# EAGLE design AA Sensor Board Reference Design (EAGLE 9.0.0)
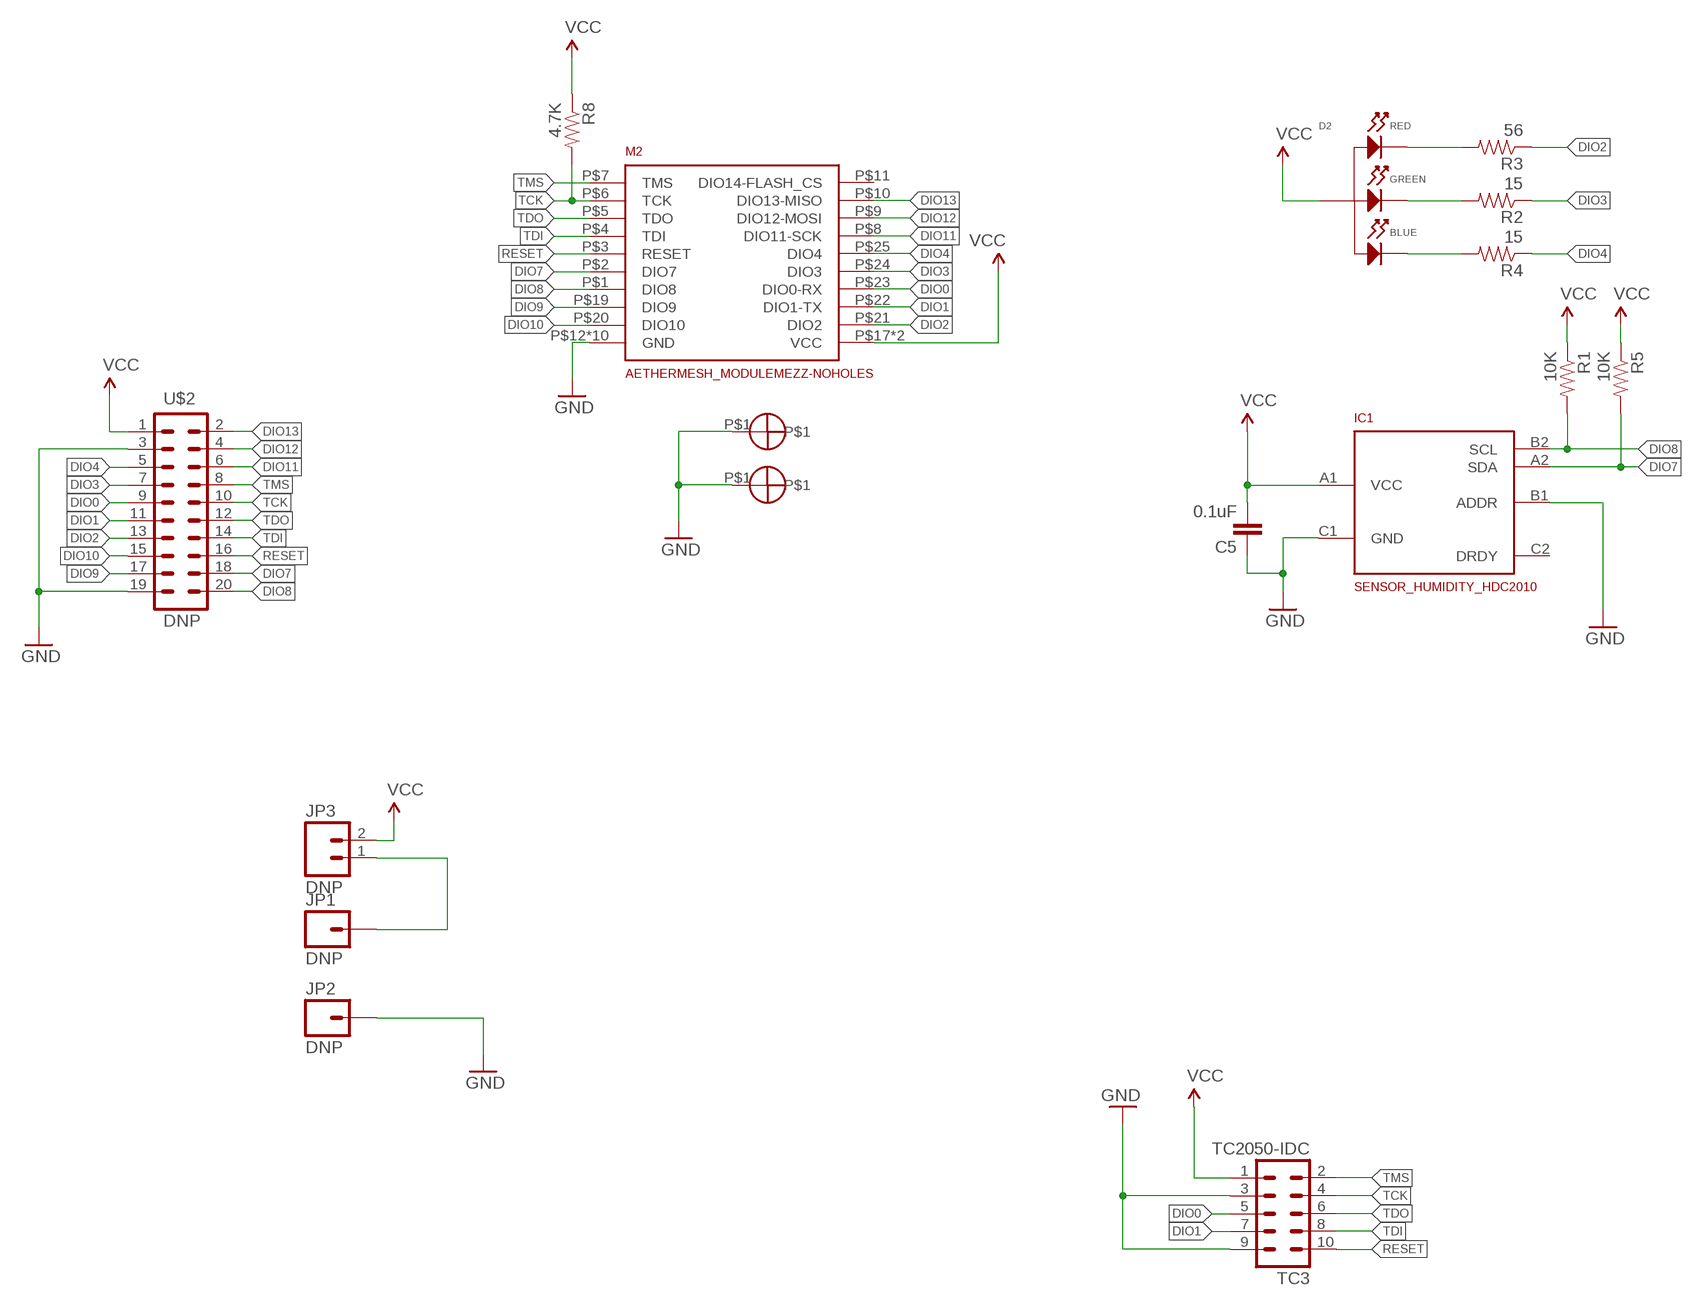
[diagram p0: schematic, sheet 1]

## Parts
C5  0.1uF  CAPC0402  [C0402]
D2  LED_RGB_CA_PLCC4  [PLCC4]
IC1  SENSOR_HUMIDITY_HDC2010  [HDC2010]
JP1  DNP  M01BAT_SLOT  [1X01_3.5X.75_BATT_SLOT]
JP2  DNP  M01BAT_SLOT  [1X01_3.5X.75_BATT_SLOT]
JP3  DNP  M02LOCK  [1X02_LOCK]
M2  AETHERMESH_MODULEMEZZ-NOHOLES  [AETHERMESH_MEZZ_MOUNT_NOHOLES]
R1  10K  RESISTORR0402  [R0402]
R2  15  RESISTORR0402  [R0402]
R3  56  RESISTORR0402  [R0402]
R4  15  RESISTORR0402  [R0402]
R5  10K  RESISTORR0402  [R0402]
R8  4.7K  RESISTORR0402  [R0402]
S3  STANDOFFWURTH  [STANDOFF_WURTH_9774040243R]
S4  STANDOFFWURTH  [STANDOFF_WURTH_9774040243R]
TC3  TC2050-IDC  [TC2050-IDC]
U$2  DNP  M10X22X10_LOCK  [2X10_LOCK]

## Nets
B2: D2.P$2(CATHODE_RED) R3.P$2
DIO0: M2.P$23(DIO0-RX) TC3.5 U$2.9
DIO1: M2.P$22(DIO1-TX) TC3.7 U$2.11
DIO2: M2.P$21(DIO2) R3.P$1 U$2.13
DIO3: M2.P$24(DIO3) R2.P$1 U$2.7
DIO4: M2.P$25(DIO4) R4.P$1 U$2.5
DIO7: IC1.A2(SDA) M2.P$2(DIO7) R5.P$2 U$2.18
DIO8: IC1.B2(SCL) M2.P$1(DIO8) R1.P$2 U$2.20
DIO9: M2.P$19(DIO9) U$2.17
DIO10: M2.P$20(DIO10) U$2.15
DIO11: M2.P$8(DIO11-SCK) U$2.6
DIO12: M2.P$9(DIO12-MOSI) U$2.4
DIO13: M2.P$10(DIO13-MISO) U$2.2
G2: D2.P$3(CATHODE_GREEN) R2.P$2
GND: C5.P$1 IC1.B1(ADDR) IC1.C1(GND) JP2.P$1 M2.P$12(GND) M2.P$13(GND) M2.P$14(GND) M2.P$15(GND) M2.P$16(GND) M2.P$26(GND) M2.P$27(GND) M2.P$28(GND) M2.P$29(GND) M2.P$30(GND) S3.P$1 S4.P$1 TC3.3 TC3.9 U$2.3 U$2.19
N$4: JP1.P$1 JP3.1
R2: D2.P$4(CATHODE_BLUE) R4.P$2
RESET: M2.P$3(RESET) TC3.10 U$2.16
TCK: M2.P$6(TCK) R8.P$2 TC3.4 U$2.10
TDI: M2.P$4(TDI) TC3.8 U$2.14
TDO: M2.P$5(TDO) TC3.6 U$2.12
TMS: M2.P$7(TMS) TC3.2 U$2.8
VCC: C5.P$2 D2.P$1(ANODE) IC1.A1(VCC) JP3.2 M2.P$17(VCC) M2.P$18(VCC) R1.P$1 R5.P$1 R8.P$1 TC3.1 U$2.1
Unconnected: IC1.C2(DRDY) M2.P$11(DIO14-FLASH_CS)

## Library data of the parts
C5 = 2. growflux:CAP: Capacitor Standard 0603 ceramic capacitor, and 0.1" leaded capacitor.; MFG#: MF-CAP-0402-0.1uF
D2 = MF_LEDs:LED_RGB_CA: Library: MF_LEDs Description: Device for RGB LED Packages with Common Anodes. Manufacture part number (MFG#) can be added via Attributes.; MFG#: MF-LED-3228-RGB
IC1 = 3. growflux:SENSOR_HUMIDITY_HDC2010
JP1 JP2 = 3. growflux:M01: Header 1 Standard 1-pin 0.1" header. Use with straight break away headers (SKU : PRT-00116), right angle break away headers (PRT-00553), swiss pins (PRT-00743), machine pins (PRT-00117), and female headers (PRT-00115).
JP3 = 1. growflux:M02: Header 2 Standard 2-pin 0.1" header. Use with straight break away headers (SKU : PRT-00116), right angle break away headers (PRT-00553), swiss pins (PRT-00743), machine pins (PRT-00117), and female headers (PRT-00115). Molex polarized connector foot print use with SKU : PRT-08233 with associated crimp pins and housings.
M2 = AetherConnectivity:AETHERMESH_MODULE
R1 R5 = 3. growflux:RESISTOR: Resistor Basic schematic elements and footprints for 0603, 1206, and PTH resistors.; MFG#: MF-RES-0402-10K
R2 R4 = 3. growflux:RESISTOR: Resistor Basic schematic elements and footprints for 0603, 1206, and PTH resistors.; ALT#: ERJ-2GEJ150X; MFG#: RC0402JR-0715RL
R3 = 3. growflux:RESISTOR: Resistor Basic schematic elements and footprints for 0603, 1206, and PTH resistors.; ALT#: RMCF0402JT56R0; MFG#: RC0402JR-0756RL
R8 = 3. growflux:RESISTOR: Resistor Basic schematic elements and footprints for 0603, 1206, and PTH resistors.; MFG#: MF-RES-0402-4.7K
S3 S4 = AetherConnectivity:STANDOFF; MFG#: 9774040243R
TC3 = TagConnect:TC2050-IDC: Tag-Connect In Circuit Programming & Debug Cable 10 Pin http://www.tag-connect.com
U$2 = 3. growflux:M10X2: This was SPECIALLY designed to be used with our Graphic LCD Backpack. Be sure you want to use this! It is not only staggered on each line of header holes, but IT IS ALSO offset of the center point of the top and bottom lines by 5 mil. This causes the headers to lock into place on the "standard" footprint on the LCD screen. The extra squares on the tdocu layer are there simply to reference other pins (if you were to actually populate a longer header than ten long - this is what we do with the backpacks).

## Board
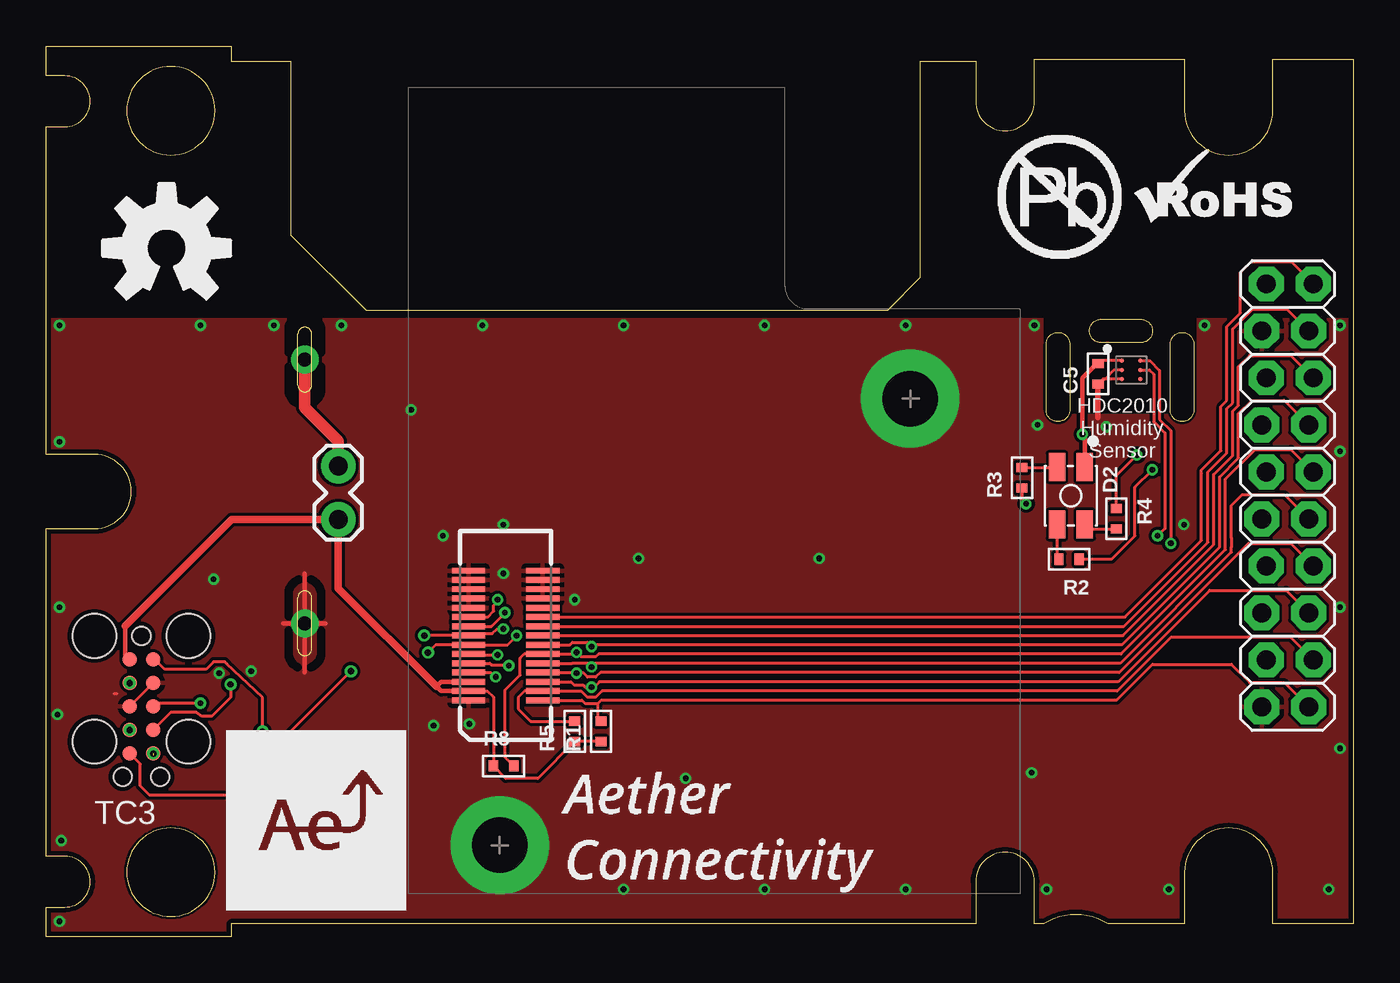
[diagram p1: board, top side]
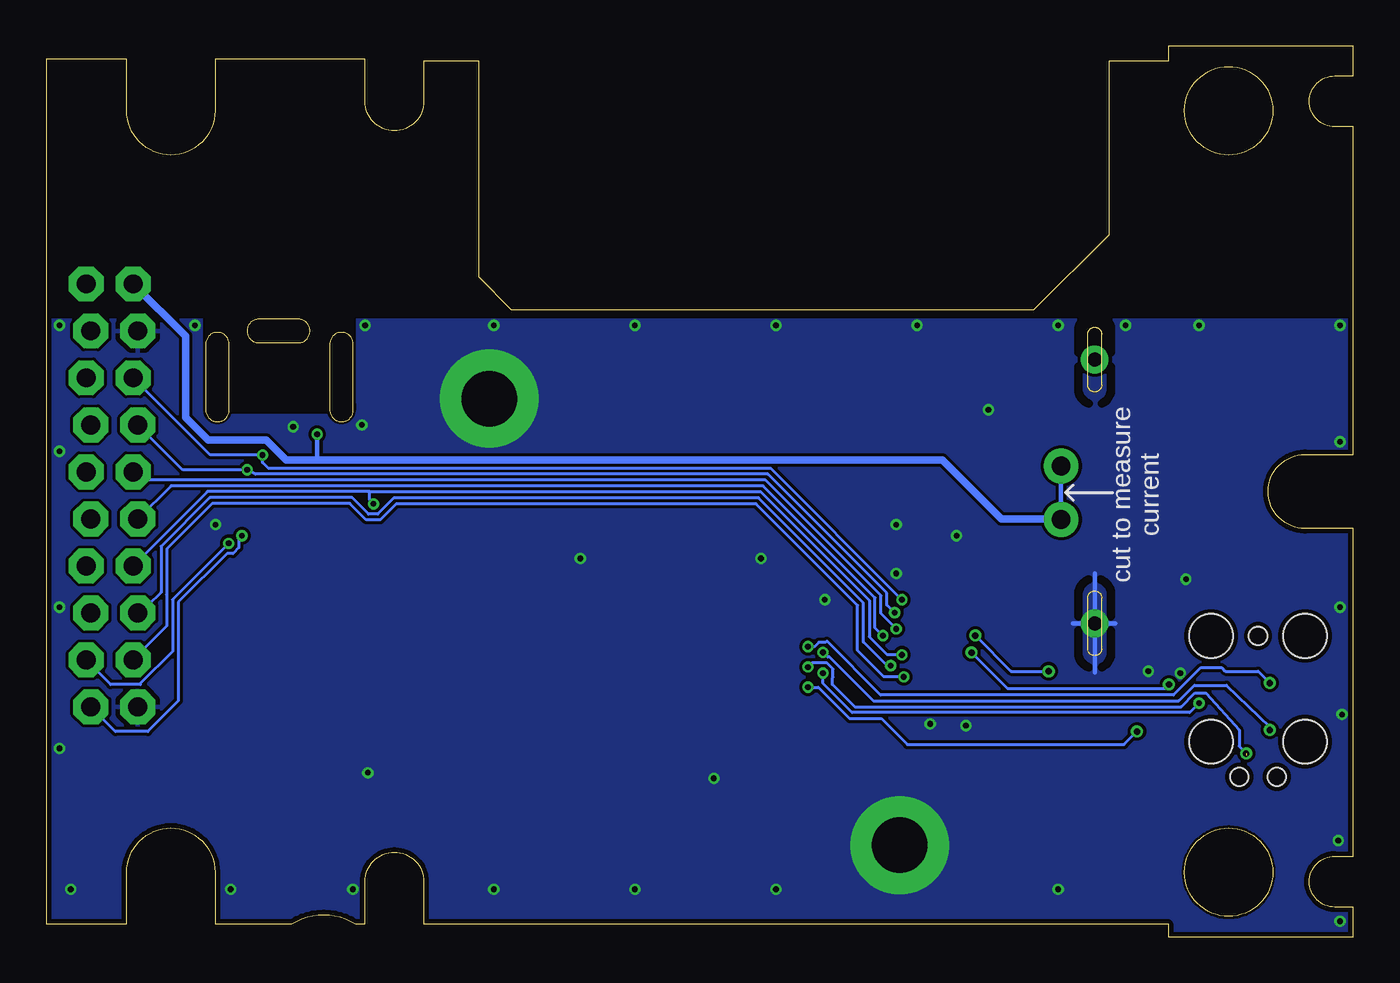
[diagram p2: board, bottom side, seen from below]

Size 70.61 x 48.12 mm. Coordinates in mm from the lower left corner, seen from the top.
Outline: 50.21,45.14 arc180 53.39,45.14 53.39,47.43 61.49,47.43 61.49,44.63 arc180 66.27,44.63 66.27,47.43 70.61,47.43 70.61,0.69 66.27,0.69 66.27,3.48 arc180 61.49,3.48 61.49,0.69 57.35,0.69 arc66 53.9,0.69 53.39,0.69 53.39,2.98 arc180 50.21,2.98 50.21,0.69 10,0.69 10,0 0,0 0,1.6 1,1.6 arc180 1,4.35 0,4.35 0,22.06 2.6,22.06 arc180 2.6,26.06 0,26.06 0,43.76 1,43.76 arc180 1,46.51 0,46.51 0,48.12 10,48.12 10,47.31 13.21,47.31 13.21,37.92 17.27,33.85 45.46,33.85 47.24,35.63 47.24,47.31 50.21,47.31 50.21,45.14
Copper layers (1*2*3*16): Top 0.035mm / dielectric 1.5mm / Route2 0.035mm / dielectric 0.15mm / Route3 0.035mm / dielectric 0.2mm / Bottom 0.035mm
Design rules "default *": minimum track width 6mil, minimum drill 10mil, track to track 6.5mil, track to pad 6.5mil, pad to pad 6.5mil, via to via 6.5mil, smd to smd 6mil, copper to edge 10mil, drill to drill 4mil, minimum pad ring 10mil, minimum via ring 6mil, stop-mask expansion 4mil, vias tented up to drill 20mil, thermal gap 10mil
tRestrict: area 54,28.4 to 62,33.4; 5 lines
bRestrict: area 54,28.4 to 62,33.4; 4 lines
Milling: 23 lines

### Footprints (pad centres in the part's own frame; a part is rotated, then mirrored left to right if it is on the bottom)
C0402 = smd 0.5 x 0.6: P$1 -0.55,0; P$2 0.55,0
PLCC4 = smd 1.5 x 0.9: P$1 -1.55,0.75; P$2 -1.55,-0.75; P$3 1.55,-0.75; P$4 1.55,0.75
HDC2010 = smd 0.25 x 0.25: A1 -0.5,0.5; A2 0.5,0.5; B1 -0.5,0; B2 0.5,0; C1 -0.5,-0.5; C2 0.5,-0.5
1X01_3.5X.75_BATT_SLOT = drill 0.75 pad 1.5: P$1 0,0
1X02_LOCK = drill 1.016 pad 1.88: 1 -0.178,0; 2 2.718,0
AETHERMESH_MEZZ_MOUNT_NOHOLES = smd 1.8 x 0.32: P$1 2,-3.5; P$2 2,-3; P$3 2,-2.5; P$4 2,-2; P$5 2,-1.5; P$6 2,-1; P$7 2,-0.5; P$8 2,0; P$9 2,0.5; P$10 2,1; P$11 2,1.5; P$12 2,2; P$13 2,2.5; P$14 2,3; P$15 2,3.5; P$16 -2,-3.5; P$17 -2,-3; P$18 -2,-2.5; P$19 -2,-2; P$20 -2,-1.5; P$21 -2,-1; P$22 -2,-0.5; P$23 -2,0; P$24 -2,0.5; P$25 -2,1; P$26 -2,1.5; P$27 -2,2; P$28 -2,2.5; P$29 -2,3; P$30 -2,3.5
R0402 = smd 0.5 x 0.6: P$1 -0.55,0; P$2 0.55,0
STANDOFF_WURTH_9774040243R = drill 3 pad 5.3: P$1 0,0
TC2050-IDC = smd 0.787 x 0.787: 1 -2.54,-0.635; 2 -1.27,-0.635; 3 0,-0.635; 4 1.27,-0.635; 5 2.54,-0.635; 6 2.54,0.635; 7 1.27,0.635; 8 0,0.635; 9 -1.27,0.635; 10 -2.54,0.635 | hole 0.991: -3.81,0; 3.81,1.016; 3.81,-1.016 | hole 2.375: -3.81,2.54; -3.81,-2.54; 1.905,2.54; 1.905,-2.54
2X10_LOCK = drill 1.016 pad 1.88 octagon: 1 -11.43,-1.143; 2 -11.43,1.397; 3 -8.89,-1.397; 4 -8.89,1.143; 5 -6.35,-1.143; 6 -6.35,1.397; 7 -3.81,-1.397; 8 -3.81,1.143; 9 -1.27,-1.143; 10 -1.27,1.397; 11 1.27,-1.397; 12 1.27,1.143; 13 3.81,-1.143; 14 3.81,1.397; 15 6.35,-1.397; 16 6.35,1.143; 17 8.89,-1.143; 18 8.89,1.397; 19 11.43,-1.397; 20 11.43,1.143

### Placement (x,y rotation side)
C5  56.83,30.42 90 top
D2  55.36,23.83 270 top
IC1  58.62,30.62 0 top
JP1  13.97,31.18 90 top
JP2  13.97,16.94 90 top
JP3  15.78,25.26 270 top
M2  24.82,16.28 0 top
R1  29.97,11.09 90 top
R2  55.26,20.4 180 top
R3  52.72,24.8 90 top
R4  57.82,22.58 270 top
R5  28.55,11.09 90 top
R8  24.7,9.23 0 top
S3  46.68,29.08 0 top
S4  24.5,4.95 0 top
TC3  5.14,12.44 270 top
U$2  67.06,23.85 270 top
U$3  [OSHW-LOGO-L]  6.5,37.2 0 top

### Tracks (layer width: path | path; a pad name or v marks a point on that pad's centre or on a via)
B2
  Top 0.152: R3.P$2 54.58,25.35 D2.P$2
DIO0  (via drill 0.3, 0.35 pad 0.3)
  Top 0.152: v24.69,16.63 24.35,16.63 24.1,16.37 22.92,16.37 M2.P$23 v20.42,16.28 v20.42,16.27 | v16.46,14.34 9.75,7.64 5.59,7.64 5.08,8.15 5.08,9.33 TC3.5
  Bottom 0.152: U$2.9 65.49,24.68 31.76,24.68 25.51,18.44 25.51,17.47 24.79,16.74 v24.69,16.63 | v20.42,16.27 18.49,14.34 v16.46,14.34
DIO1  (via drill 0.3, 0.35 pad 0.3)
  Top 0.152: v25.41,16.26 24.93,15.78 M2.P$22 21.04,15.78 v20.62,15.36 | v9.95,13.63 9.95,12.92 8.94,11.91 8.43,11.91 8.13,12.11 6.71,12.11 TC3.7
  Bottom 0.152: U$2.11 63.88,24.36 31.89,24.36 25.83,18.31 25.83,16.68 v25.41,16.26 | v20.62,15.36 18.69,13.43 10.16,13.43 v9.95,13.63
DIO2  (via drill 0.3)
  Top 0.152: M2.P$21 22.87,15.23 v24.38,15.23 | R3.P$1 52.72,23.6 v52.93,23.39
  Bottom 0.152: 53.13,24.05 61.92,24.05 61.92,24.03 U$2.13 | v24.38,15.23 24.51,15.26 25.19,15.26 26.15,16.21 26.15,18.17 32.02,24.05 53.13,24.05 | v52.93,23.39 53.13,23.59 53.13,24.05
DIO3  (via drill 0.3)
  Top 0.152: M2.P$24 24.05,16.78 v24.78,17.5 | R2.P$1 57.56,20.4 58.82,21.66 58.82,23.39 58.82,23.48 58.82,24.29 v59.76,25.23
  Bottom 0.152: v24.78,17.5 25.19,17.92 25.19,18.57 31.63,25 59.33,25 v59.76,25.23 63.24,25.23 U$2.7
DIO4  (via drill 0.3)
  Top 0.152: M2.P$25 22.83,17.29 23.87,17.29 24.18,17.6 24.18,17.9 24.38,18.1 v24.38,18.21 | v58.93,26.03 57.82,24.92 R4.P$1
  Bottom 0.152: v24.38,18.21 31.49,25.32 58.62,25.32 58.93,25.62 v58.93,26.03 61.75,26.03 U$2.5
DIO7  (via drill 0.3)
  Top 0.152: U$2.18 67.24,16.17 60.76,16.17 57.87,13.28 30.03,13.28 29.69,12.93 29.24,12.93 28.89,13.28 M2.P$2 25.85,13.28 25.5,12.92 25.5,12.31 26.17,11.64 R5.P$2 | IC1.A2 59.62,31.12 60.14,30.6 60.14,27.96 60.75,27.35 v60.75,21.25
  Bottom 0.152: U$2.18 67.14,13.63 65.53,13.63 65.53,13.67 63.79,15.41 63.79,18.22 v60.75,21.25
DIO8  (via drill 0.3)
  Top 0.152: U$2.20 66.89,13.73 65.02,13.73 64.03,14.72 59.76,14.72 57.82,12.78 29.98,12.78 29.82,12.62 | IC1.B2 59.6,30.62 59.83,30.4 59.83,27.83 60.44,27.22 60.44,22.05 v60.04,21.66 | 29.82,12.62 29.1,12.62 28.95,12.78 M2.P$1 | R1.P$2 29.82,11.79 29.82,12.62
  Bottom 0.152: U$2.20 66.88,11.09 65.12,11.09 63.47,12.74 63.47,18.09 60.85,20.71 60.53,20.71 60.21,21.03 60.21,21.49 v60.04,21.66
DIO9  (via drill 0.3)
  Top 0.152: M2.P$19 24.01,14.28 v24.28,14.04
  Bottom 0.152: U$2.17 65.92,14.97 64.11,16.78 64.11,18.47 64.09,18.48 64.09,20.96 61.64,23.41 54.22,23.41 53.33,22.52 52.57,22.52 51.7,23.39 32.26,23.39 26.78,17.91 26.78,15.46 25.36,14.04 v24.28,14.04
DIO10  (via drill 0.3)
  Top 0.152: M2.P$20 23.96,14.78 24.05,14.68 25.16,14.68 v24.99,14.65
  Bottom 0.152: U$2.15 65.46,17.7 65.12,17.9 64.41,18.61 64.41,21.09 61.78,23.73 54.09,23.73 53.2,22.84 52.7,22.84 51.83,23.71 32.13,23.71 26.46,18.04 26.46,15.92 25.19,14.65 v24.99,14.65
DIO11
  Top 0.152: M2.P$8 58.17,16.28 63.08,21.18 63.08,24.98 64.09,26 64.09,28.4 64.41,28.71 64.41,30.8 65.02,31.41 67.24,31.41 U$2.6
DIO12
  Top 0.152: M2.P$9 58.22,16.78 62.76,21.31 62.76,25.11 63.78,26.13 63.78,28.53 64.09,28.84 64.09,32.84 65.18,33.92 67.02,33.92 U$2.4
DIO13
  Top 0.152: M2.P$10 58.27,17.28 62.42,21.42 62.42,25.03 62.42,25.22 63.46,26.26 63.46,28.66 63.78,28.98 63.78,32.97 64.51,33.7 64.51,35.88 65.09,36.46 67.29,36.46 68.46,35.29 U$2.2
G2
  Top 0.152: D2.P$3 54.61,20.5 R2.P$2
GND  (via drill 0.3)
  Top 0.152: IC1.C1 57.08,30.12 57.08,30.11 | 57.08,30.11 C5.P$1 | IC1.B1 57.69,30.62 57.18,30.11 57.08,30.11 | TC3.3 TC3.9 | 3.83,13.13 3.66,13.13
  Top 0.254: 12.8,16.94 JP2.P$1 | JP2.P$1 15.09,16.94 | JP2.P$1 13.97,14.29 | JP2.P$1 13.97,19.63
  Top 0.305: C5.P$1 56.83,28.07 56.82,28.06
  Bottom 0.254: 15.14,16.94 JP2.P$1 | JP2.P$1 12.85,16.94 | JP2.P$1 13.97,19.63 | JP2.P$1 13.97,14.29
  other vias: 0.71,33.04 8.33,33.04 15.95,33.04 23.57,33.04 31.19,33.04 38.81,33.04 46.43,33.04 69.9,33.04 0.71,26.74 0.71,17.8 0.61,12.01 0.71,0.83 15.95,2.56 31.19,2.56 38.81,2.56 46.43,2.56 54.05,2.56 60.65,2.56 69.29,2.56 69.9,26.23 69.9,17.8 69.9,10.18 0.81,5.2 41.75,20.44 12.29,33.04 34.54,8.55 53.24,8.86 11.07,14.34 9.04,19.32 19.71,28.47 24.69,22.27 21.43,21.66 32,20.44 53.39,33.04 53.57,27.65 57.27,27.55 62.58,33.04 61.47,22.27 22.86,11.5 20.93,11.4 28.55,18.21 24.69,19.63 9.34,14.24
  pour Top (isolate 0.152): -1.53,32.33 -1.53,-1.96 -1.27,-2.22 71.63,-2.22 71.63,33.34 -1.53,33.34
  pour Bottom (isolate 0.152): -1.02,32.33 -1.02,-1.96 -0.76,-2.22 72.13,-2.22 72.13,33.34 -1.02,33.34
N$1
  Bottom 0.254: 15.8,25.47 15.8,22.52
N$4
  Top 0.61: 15.78,25.25 JP3.1 15.78,26.78 13.97,28.6 JP1.P$1
R2
  Top 0.152: D2.P$4 56.35,22.03 R4.P$2
RESET  (via drill 0.3, 0.35)
  Top 0.152: U$2.16 66.99,18.71 62.86,18.71 57.92,13.78 29.89,13.78 29.59,13.48 v29.46,13.48 29.14,13.48 29.03,13.59 28.53,13.59 28.34,13.78 M2.P$3 | v11.68,11.09 11.68,12.92 9.75,14.75 9.65,14.85 9.04,14.85 8.63,14.45 6.4,14.45 6.09,14.75 5.91,14.85 5.85,14.91 5.85,15.01 | 5.85,15.01 5.83,15.04 | TC3.10 5.81,15.01 5.85,15.01
  Bottom 0.152: v29.46,13.48 28.9,13.48 27.21,11.79 25.5,11.79 24.09,10.38 12.39,10.38 v11.68,11.09
TCK  (via drill 0.3, 0.35 pad 0.3)
  Top 0.152: U$2.10 67.24,26.33 65.33,26.33 63.71,24.72 63.71,20.92 58.07,15.28 29.84,15.28 29.69,15.12 28.89,15.12 v28.65,15.36 28.56,15.28 M2.P$6 25.82,15.28 25.6,15.06 25.6,14.14 24.79,13.33 24.79,9.69 R8.P$2 | 4.43,11.17 4.43,11.21 4.47,11.21 TC3.4
  Bottom 0.152: v28.65,15.36 28.39,15.11 28.29,15.11 25.93,12.74 9.42,12.74 8.58,13.58 6.86,13.58 4.51,11.34 TC3.4
  other vias: 4.51,11.17
TDI  (via drill 0.3)
  Top 0.152: U$2.14 67.24,21.25 64.95,21.25 57.97,14.28 29.94,14.28 29.69,14.03 29.24,14.03 29.02,14.24 v28.65,14.24 28.62,14.28 M2.P$4 | 5.85,12.37 5.91,12.41 5.89,12.52 5.99,12.62 v8.33,12.62 | 5.85,12.37 5.85,12.44 | TC3.8 5.85,12.37
  Bottom 0.152: v8.33,12.62 8.84,12.11 27.08,12.11 28.65,13.68 v28.65,14.24
TDO  (via drill 0.3, 0.35 pad 0.3)  (1 unrouted)
  Top 0.152: U$2.12 66.89,23.89 64.62,23.89 64.03,23.31 64.03,21.56 64.03,21.05 64.03,20.79 58.02,14.78 29.66,14.78 v29.46,14.57 29.25,14.79 28.42,14.79 28.41,14.78 M2.P$5 | 5.78,9.77 5.78,9.8
  Bottom 0.152: v29.46,14.57 29.25,14.79 28.42,14.79 28.1,14.47 28.1,14.02 28.14,13.98 28.14,13.63 26.93,12.43 9.29,12.43 8.55,13.16 7.96,13.16 6.17,11.17 6.17,10.29 TC3.6
  other vias: 5.78,9.9
TMS  (via drill 0.3, 0.35 pad 0.3)
  Top 0.152: U$2.8 66.89,28.97 65.12,28.97 64.41,28.26 64.41,25.87 63.4,24.85 63.4,21.05 58.12,15.78 29.57,15.78 v29.46,15.67 29.22,15.91 28.42,15.91 28.29,15.78 M2.P$7
  Bottom 0.152: v29.46,15.67 29.12,15.67 28.87,15.91 28.51,15.91 28.45,15.97 25.54,13.06 9.71,13.06 8.23,14.55 7.11,14.55 6.91,14.34 5.14,14.34 TC3.2
  other vias: 4.51,13.71
VCC  (via drill 0.3)
  Top 0.152: IC1.A1 56.98,31.12 C5.P$2 | M2.P$17 23.82,13.28 24.15,12.95 R8.P$1 24.83,8.55 26.56,8.55 R5.P$1 R1.P$1 | TC3.1 4.26,15.23
  Top 0.254: M2.P$17 21.34,13.28 21.08,13.53 21.32,13.78 M2.P$18 | D2.P$1 56.11,27.02 v55.98,27.15 55.98,30.19 56.75,30.97 C5.P$2 | 4.26,15.23 4.26,16.78
  Top 0.406: 4.26,16.78 10.02,22.54 JP3.2 15.78,18.83 21.08,13.53
  Bottom 0.254: v55.98,27.15 55.98,25.76
  Bottom 0.406: U$2.1 63.09,32.45 63.09,28.06 61.87,26.84 58.72,26.84 57.64,25.76 55.98,25.76 22.18,25.76 19,22.57 15.81,22.57 JP3.2

### Text on the board
tPlace: HDC2010 / Humidity / Sensor
bPlace: cut to measure / current